# Altium schematic sheet MB1-MCU-r1.0.SchDoc: STM32F103
size A; DrawnBy: MBoard team; DocumentNumber: 2; Revision: 1.1; SheetNumber: 2; SheetTotal: 7
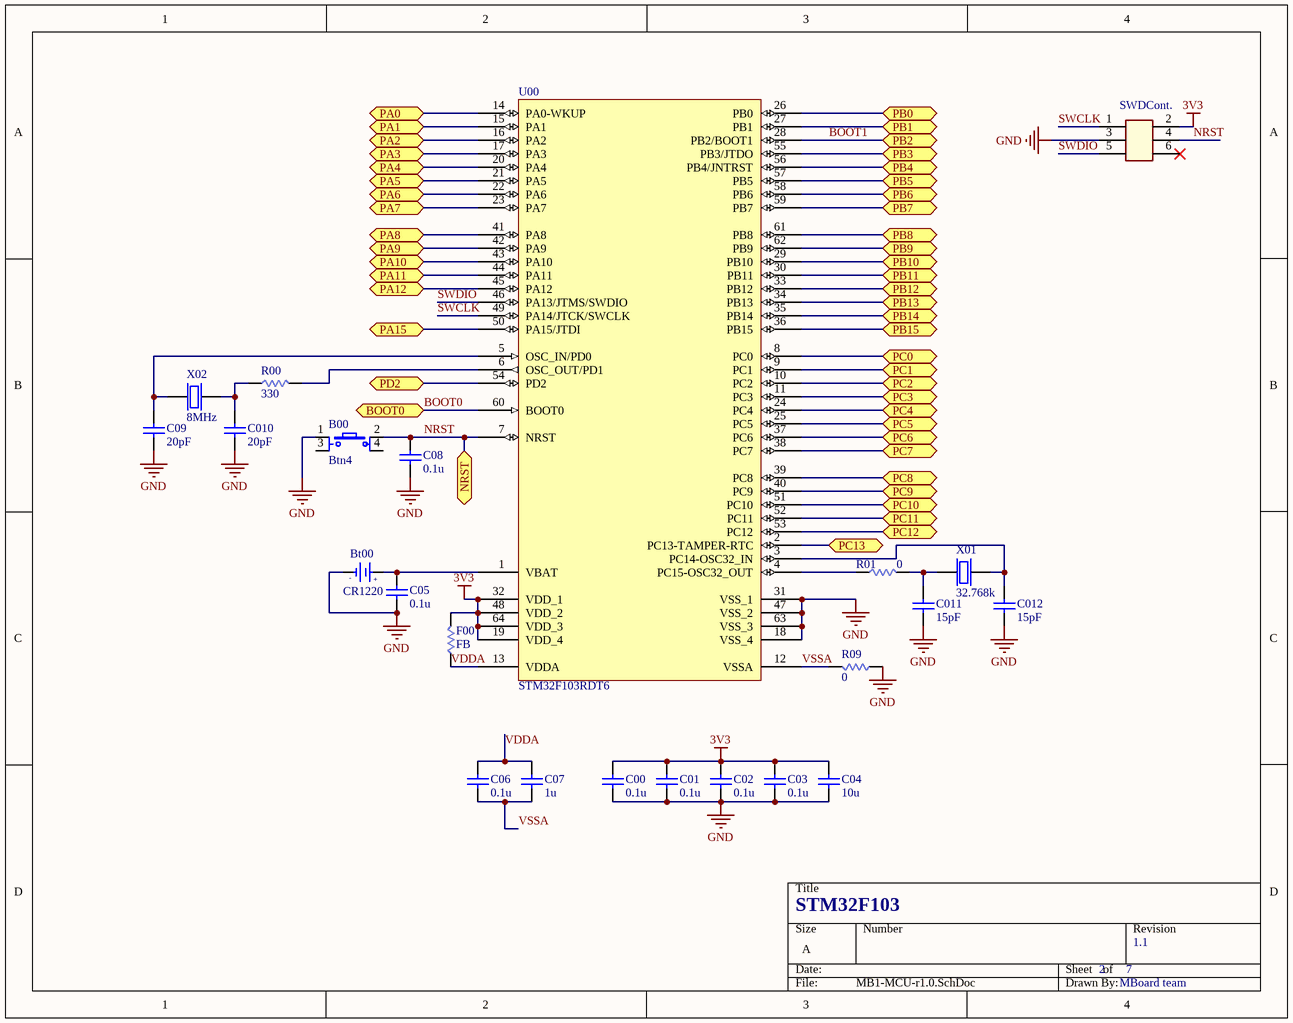
[diagram p0: MB1-MCU-r1.0.SchDoc]

## Parts
B00  Btn4  [Horizon_SW_4pin_rectangular]
Bt00  value CR1220  [PIN3VSOCKET-SMD]  (hidden comment: PIN 3V)
C00  value 0.1u  [SM_0805_LD]  (hidden comment: CAP Ceramic)
C01  value 0.1u  [SM_0805_LD]  (hidden comment: CAP Ceramic)
C02  value 0.1u  [SM_0805_LD]  (hidden comment: CAP Ceramic)
C03  value 0.1u  [SM_0805_LD]  (hidden comment: CAP Ceramic)
C04  value 10u  [SM_0805_LD]  (hidden comment: CAP Ceramic)
C05  value 0.1u  [SM_0805_LD]  (hidden comment: CAP Ceramic)
C06  value 0.1u  [SM_0805_LD]  (hidden comment: CAP Ceramic)
C07  value 1u  [SM_0805_LD]  (hidden comment: CAP Ceramic)
C08  value 0.1u  [SM_0805_LD]  (hidden comment: CAP Ceramic)
C09  value 20pF  [SM_0805_LD]  (hidden comment: CAP Ceramic)
C010  value 20pF  [SM_0805_LD]  (hidden comment: CAP Ceramic)
C011  value 15pF  [SM_0805_LD]  (hidden comment: CAP Ceramic)
C012  value 15pF  [SM_0805_LD]  (hidden comment: CAP Ceramic)
F00  value FB  [SM_0805_LD]  (hidden comment: Ferrite bead)
R00  value 330  [SM_0805_LD]
R01  value 0  [SM_0805_LD]
R09  value 0  [SM_0805_LD]
SWDCont.  SWD  [Hed3x2-RA]  (value not drawn)
U00  STM32F103RDT6  [LQFP64_L]
X01  value 32.768k  [XT32-LOB]  (hidden comment: Crystal 32.768 k)
X02  value 8MHz  [HC49/US-SMD]  (hidden comment: Crystal 2 pin.)

## Ports
BOOT0 (bidir), NRST (bidir), PA0 (bidir), PA1 (bidir), PA2 (bidir), PA3 (bidir), PA4 (bidir), PA5 (bidir), PA6 (bidir), PA7 (bidir), PA8 (bidir), PA9 (bidir), PA10 (bidir), PA11 (bidir), PA12 (bidir), PA15 (bidir), PB0 (bidir), PB1 (bidir), PB2 (bidir), PB3 (bidir), PB4 (bidir), PB5 (bidir), PB6 (bidir), PB7 (bidir), PB8 (bidir), PB9 (bidir), PB10 (bidir), PB11 (bidir), PB12 (bidir), PB13 (bidir), PB14 (bidir), PB15 (bidir), PC0 (bidir), PC1 (bidir), PC2 (bidir), PC3 (bidir), PC4 (bidir), PC5 (bidir), PC6 (bidir), PC7 (bidir), PC8 (bidir), PC9 (bidir), PC10 (bidir), PC11 (bidir), PC12 (bidir), PC13 (bidir), PD2 (bidir)

## Nets
3V3: C00.2 C01.2 C02.2 C03.2 C04.2 F00.2 SWDCont..2 U00.19(VDD_4) U00.32(VDD_1) U00.48(VDD_2) U00.64(VDD_3)
GND: B00.1(Tab) Bt00.2(GND) C00.1 C01.1 C02.1 C03.1 C04.1 C05.1 C08.1 C09.1 C010.1 C011.1 C012.1 R09.1 SWDCont..3 U00.18(VSS_4) U00.31(VSS_1) U00.47(VSS_2) U00.63(VSS_3)
BOOT0: U00.60(BOOT0) ; port BOOT0
BOOT1: U00.28(PB2/BOOT1) ; port PB2
NRST: B00.2(Tab) C08.2 SWDCont..4 U00.7(NRST) ; port NRST
PA0: U00.14(PA0-WKUP) ; port PA0
PA1: U00.15(PA1) ; port PA1
PA2: U00.16(PA2) ; port PA2
PA3: U00.17(PA3) ; port PA3
PA4: U00.20(PA4) ; port PA4
PA5: U00.21(PA5) ; port PA5
PA6: U00.22(PA6) ; port PA6
PA7: U00.23(PA7) ; port PA7
PA8: U00.41(PA8) ; port PA8
PA9: U00.42(PA9) ; port PA9
PA10: U00.43(PA10) ; port PA10
PA11: U00.44(PA11) ; port PA11
PA12: U00.45(PA12) ; port PA12
PA15: U00.50(PA15/JTDI) ; port PA15
PB0: U00.26(PB0) ; port PB0
PB1: U00.27(PB1) ; port PB1
PB3: U00.55(PB3/JTDO) ; port PB3
PB4: U00.56(PB4/JNTRST) ; port PB4
PB5: U00.57(PB5) ; port PB5
PB6: U00.58(PB6) ; port PB6
PB7: U00.59(PB7) ; port PB7
PB8: U00.61(PB8) ; port PB8
PB9: U00.62(PB9) ; port PB9
PB10: U00.29(PB10) ; port PB10
PB11: U00.30(PB11) ; port PB11
PB12: U00.33(PB12) ; port PB12
PB13: U00.34(PB13) ; port PB13
PB14: U00.35(PB14) ; port PB14
PB15: U00.36(PB15) ; port PB15
PC0: U00.8(PC0) ; port PC0
PC1: U00.9(PC1) ; port PC1
PC2: U00.10(PC2) ; port PC2
PC3: U00.11(PC3) ; port PC3
PC4: U00.24(PC4) ; port PC4
PC5: U00.25(PC5) ; port PC5
PC6: U00.37(PC6) ; port PC6
PC7: U00.38(PC7) ; port PC7
PC8: U00.39(PC8) ; port PC8
PC9: U00.40(PC9) ; port PC9
PC10: U00.51(PC10) ; port PC10
PC11: U00.52(PC11) ; port PC11
PC12: U00.53(PC12) ; port PC12
PC13: U00.2(PC13-TAMPER-RTC) ; port PC13
PD2: U00.54(PD2) ; port PD2
SWCLK: SWDCont..1 U00.49(PA14/JTCK/SWCLK)
SWDIO: SWDCont..5 U00.46(PA13/JTMS/SWDIO)
VDDA: C06.2 C07.2 F00.1 U00.13(VDDA)
VSSA: C06.1 C07.1 R09.2 U00.12(VSSA)
NetBt00_1: Bt00.1(+3V) C05.2 U00.1(VBAT)
NetC09_2: C09.2 U00.5(OSC_IN/PD0) X02.1(Xin)
NetC010_2: C010.2 R00.1 X02.2(Xout)
NetC011_2: C011.2 R01.2 X01.1(Xin)
NetC012_2: C012.2 U00.3(PC14-OSC32_IN) X01.2(Xout)
NetR00_2: R00.2 U00.6(OSC_OUT/PD1)
NetR01_1: R01.1 U00.4(PC15-OSC32_OUT)

Not connected (* = marked no-connect by the designer): B00 3(Tab) 4(Tab); SWDCont. 6*

## Notes on the sheet
- (in symbol PIN 3V) -; +

## Library data of the parts
Bt00 = PIN 3V: Battery 3VDC
C00 C01 C02 C03 C04 C05 C06 C07 C08 C09 C010 C011 C012 = CAP Ceramic: Non-polarity ceramic capacitor; Published: 8-Jun-2000; LatestRevisionDate: 17-Jul-2002; LatestRevisionNote: Re-released for DXP Platform.; PackageReference: RAD-0.3; Publisher: Altium Limited; PackageDescription: Radial Cap, Thru-Hole; 2 Leads; 0.3 in Pin Spacing
F00 R00 R01 R09 = R: Resistor; Published: 8-Jun-2000; LatestRevisionDate: 29-May-2009; LatestRevisionNote: IPC-7351 Footprint Added.; PackageReference: J1-0603; Publisher: Altium Limited; PackageDescription: Chip Resistor
SWDCont. = HD_3x2: Header, 3-pins/row, double row,
U00 = STM32F103RBT6: STM32 ARM-based 32-bit MCU with 128 Kbytes Flash, 64-pin LQFP, Industrial Temperature; Published: 30-May-2008; DatasheetVersion: rev6, Mar-2008; PackageVersion: Mar-2008; PackageReference: LQFP64; Publisher: Altium Limited; PackageDescription: 64-Pin Low-Profile Quad Flat Pack, 10 x 10 mm Body, 0.5 mm Pitch (LQFP64); ComponentLink1Description: Manufacturer Link; ComponentLink1URL: www.st.com/stm32; ComponentLink2Description: Datasheet; ComponentLink2URL: http://www.st.com/stonline/products/literature/ds/13587.pdf
X01 = XT32k
X02 = XT2